# EasyEDA Pro project ProProject_zelda_guardian.epro, board PCB3
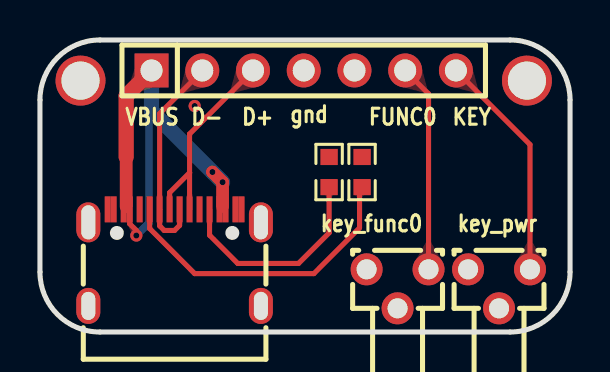
[diagram p8: board, top side]
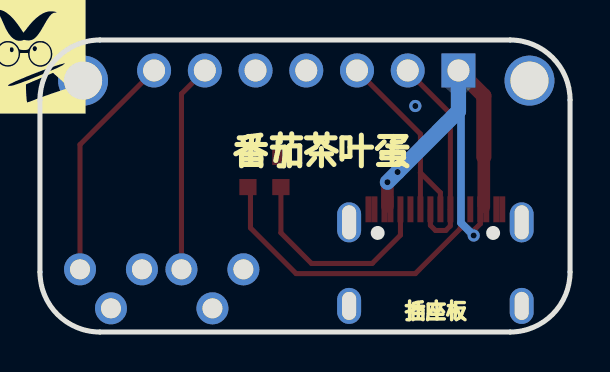
[diagram p9: board, bottom side, seen from below]

Outline 26.54 x 14.61 mm; copper layers: Top Layer, Bottom Layer. Coordinates in mm from the lower left corner of the outline.
Outline path: 0,11.61 0,3 arc(0.88,0.88) 3,0 23.54,0 arc(25.66,0.88) 26.54,3 26.54,11.61 arc(25.66,13.73) 23.54,14.61 3,14.61 arc(0.88,13.73) 0,11.61
Stack: Top Layer 0.035mm / Dielectric1 1.51mm FR4 er 4.5 / Bottom Layer 0.035mm

## Design rules (mm)
template: 自定义配置
spacing copperThickness1oz (default): track to track 0.102, other pairs 0.152 to 0.3
spacing copperThickness2oz: track to track 0.203, other pairs 0.152 to 0.3
track width copperThickness1oz (default): min 0.127, default 0.254, max 2.54
track width copperThickness2oz: min 0.203, default 0.254, max 2.54
differential pair differentialPair (default): width min 0.127, default 0.254, max 2.54; gap min 0.152, default 0.152
via viaSize (default): diameter min 0.5, default 0.61, max 10; hole min 0.3, default 0.305, max 6.3
net GND uses 全连接

## Placement (name value [footprint] x y rotation side)
H1  PZ254V-11-07P  [HDR-TH_7P-P2.54-V-M]  13.21 13.08 0 top
NOREF  -  [Pad_e414]  24.38 12.57 0 top
NOREF#2  -  [Pad_e415]  2.03 12.57 0 top
R1  5.1kΩ  [R0603]  16.13 8 270 top
R2  5.1kΩ  [R0603]  14.48 8 270 top
SW1  TS-1091B-A10B3-D2  [SW-TH_TS-1091B-A10B3-D2]  17.91 2.16 0 top
SW2  TS-1091B-A10B3-D2  [SW-TH_TS-1091B-A10B3-D2]  22.99 2.16 0 top
USB1  KH-TYPE-C-16P  [USB-C-SMD_KH-TYPE-C-16P]  6.74 3.72 0 top

## Footprints (pads in the part's own frame, mm; a bottom-side part is the same pattern mirrored in y, then rotated)
HDR-TH_7P-P2.54-V-M
  rect 1.7x1.7 hole 1.1: 1(-7.62,0)
  round 1.7 hole 1.1: 2(-5.08,0) 3(-2.54,0) 4(0,0) 5(2.54,0) 6(5.08,0) 7(7.62,0)
Pad_e414
  round 2.5 hole 1.905: 2(0,0)
Pad_e415
  round 2.5 hole 1.905: 1(0,0)
R0603
  rect 0.806x0.864 smd: 1(-0.753,0) 2(0.753,0)
SW-TH_TS-1091B-A10B3-D2
  round 1.6 hole 1: 1(-1.55,0.975) 2(1.55,0.975) 3(0,-0.975)
USB-C-SMD_KH-TYPE-C-16P
  oval 1.2x2 hole 0.7x1.7: 1(-4.32,1.765) 2(4.32,1.765)
  oval 1.2x1.8 hole 0.7x1.4: 3(-4.32,-2.415) 4(4.32,-2.415)
  rect 0.3x1.3 smd: A1(-3.35,2.415) A4(-2.55,2.415) A5(-1.25,2.415) A6(-0.25,2.415) A7(0.25,2.415) A8(1.25,2.415) A9(2.55,2.415) A12(3.35,2.415) B1(3.05,2.415) B4(2.25,2.415) B5(1.75,2.415) B6(0.75,2.415) B7(-0.75,2.415) B8(-1.75,2.415) B9(-2.25,2.415) B12(-3.05,2.415)

## Nets
As in the schematic.

Pads without a net: H1 5; NOREF 2; NOREF#2 1; USB1 A8 B8

## Via types
v1: diameter 0.61, hole 0.305, Top Layer to Bottom Layer, 4 vias

## Routing (per net, layer and track width the routed paths; a pad name or vN(x,y) marks a point on that pad's centre or on a via; arc(x,y) is an arc through that point)
VBUS: length 24.6
  Top Layer w0.254: USB1.B9 4.49,5.41 4.83,5.08 v1(4.83,4.83)
  Top Layer w0.635: 9.14,6.28 v1(9.14,7.49) v1(8.64,8) ; 4.32,8.76 4.32,6.26
  Top Layer w0.762: 5.56,13.41 5.38,13.23 5.38,12.88 4.32,11.81 4.32,8.76
  Bottom Layer w0.381: 5.59,11.05 5.46,10.92 5.46,5.46 v1(4.83,4.83)
  Bottom Layer w0.762: H1.1 5.59,11.05 v1(8.64,8) v1(9.14,7.49)
(no net):
  vias: v1(7.75,11.3)
D+: length 10.5
  Top Layer w0.254: USB1.A6 6.49,6.97 7.49,7.97 ; H1.3 7.49,9.91 7.49,7.97 ; 7.49,7.97 USB1.B6
D-: length 10.7
  Top Layer w0.254: H1.2 8.13,13.06 5.99,10.92 USB1.B7 5.99,5.31 6.22,5.08 6.74,5.08 6.99,5.33 USB1.A7
FUNC0: length 10.4
  Top Layer w0.254: H1.6 19.46,11.91 19.46,3.13
PWR: length 11.5
  Top Layer w0.254: SW2.2 24.54,9.37 H1.7
$1N401: length 10.8
  Top Layer w0.254: USB1.B5 8.49,4.84 9.91,3.43 12.95,3.43 14.48,4.96 R2.2
$1N402: length 15.4
  Top Layer w0.254: USB1.A5 5.49,5.18 7.75,2.92 13.72,2.92 16,5.21 16,7.12 R1.2

## Copper pours and planes (outline as drawn; the poured copper is in the pictures)
GND on Top Layer: -2.29,16.51 31.24,16.51 31.24,-1.14 -2.29,-1.14
GND on Bottom Layer: -0.63,15.24 32.89,15.24 32.89,-2.67 -0.63,-2.67

Small or netless copper shapes (teardrops, artwork), in the pictures only: 18 on Top Layer, 2 on Bottom Layer

## Text on the board
Bottom Silkscreen Layer: 插座板 | 番茄茶叶蛋
Top Silkscreen Layer: VBUS | D- | D+ | gnd | key_func0 | FUNC0 | KEY | key_pwr
